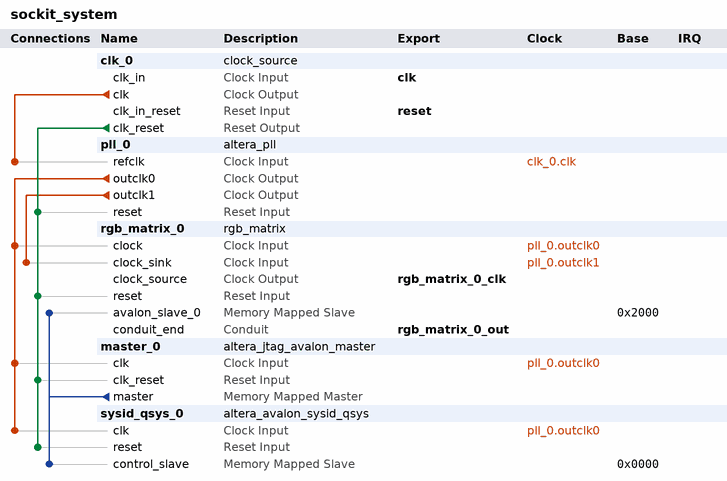
[diagram p0: system contents]
# Platform Designer (Qsys) system sockit_system, Cyclone V 5CSXFC6D6F31C8ES
# Parameters at their usual value, and those the tool derives, are not listed.
package require -exact qsys 13.1
create_system sockit_system
set_project_property DEVICE_FAMILY {Cyclone V}
set_project_property DEVICE 5CSXFC6D6F31C8ES

add_instance clk_0 clock_source 13.1
set_instance_parameter_value clk_0 clockFrequency 50000000

add_instance pll_0 altera_pll 13.1
set_instance_parameter_value pll_0 gui_device_speed_grade 8
set_instance_parameter_value pll_0 gui_pll_mode {Integer-N PLL}
set_instance_parameter_value pll_0 gui_reference_clock_frequency 50.0
set_instance_parameter_value pll_0 gui_operation_mode direct
set_instance_parameter_value pll_0 gui_use_locked false
set_instance_parameter_value pll_0 gui_number_of_clocks 2
set_instance_parameter_value pll_0 gui_output_clock_frequency0 50.0
set_instance_parameter_value pll_0 gui_output_clock_frequency1 10.0
set_instance_parameter_value pll_0 gui_pll_auto_reset On

add_instance rgb_matrix_0 rgb_matrix 0.9.3

add_instance master_0 altera_jtag_avalon_master 13.1

add_instance sysid_qsys_0 altera_avalon_sysid_qsys 13.1
set_instance_parameter_value sysid_qsys_0 id -559038242

# connections
add_connection clk_0.clk pll_0.refclk clock
add_connection pll_0.outclk0 master_0.clk clock
add_connection pll_0.outclk0 rgb_matrix_0.clock clock
add_connection pll_0.outclk0 sysid_qsys_0.clk clock
add_connection pll_0.outclk1 rgb_matrix_0.clock_sink clock
add_connection clk_0.clk_reset master_0.clk_reset reset
add_connection clk_0.clk_reset pll_0.reset reset
add_connection clk_0.clk_reset rgb_matrix_0.reset reset
add_connection clk_0.clk_reset sysid_qsys_0.reset reset
add_connection master_0.master rgb_matrix_0.avalon_slave_0 avalon
set_connection_parameter_value master_0.master/rgb_matrix_0.avalon_slave_0 baseAddress 0x2000
add_connection master_0.master sysid_qsys_0.control_slave avalon
set_connection_parameter_value master_0.master/sysid_qsys_0.control_slave baseAddress 0x0000

# exported interfaces
add_interface clk clock sink
set_interface_property clk EXPORT_OF clk_0.clk_in
add_interface reset reset sink
set_interface_property reset EXPORT_OF clk_0.clk_in_reset
add_interface rgb_matrix_0_out conduit end
set_interface_property rgb_matrix_0_out EXPORT_OF rgb_matrix_0.conduit_end
add_interface rgb_matrix_0_clk clock source
set_interface_property rgb_matrix_0_clk EXPORT_OF rgb_matrix_0.clock_source

set_interconnect_requirement {$system} qsys_mm.clockCrossingAdapter HANDSHAKE
set_interconnect_requirement {$system} qsys_mm.maxAdditionalLatency 1
set_interconnect_requirement {$system} qsys_mm.insertDefaultSlave false

save_system sockit_system.qsys
